# Altium schematic sheet Diagrama de Blocos.SchDoc: Diagrama de Blocos
size A4; DrawnBy: João Bortolace; Revision: 1.0; SheetNumber: 1; SheetTotal: 8
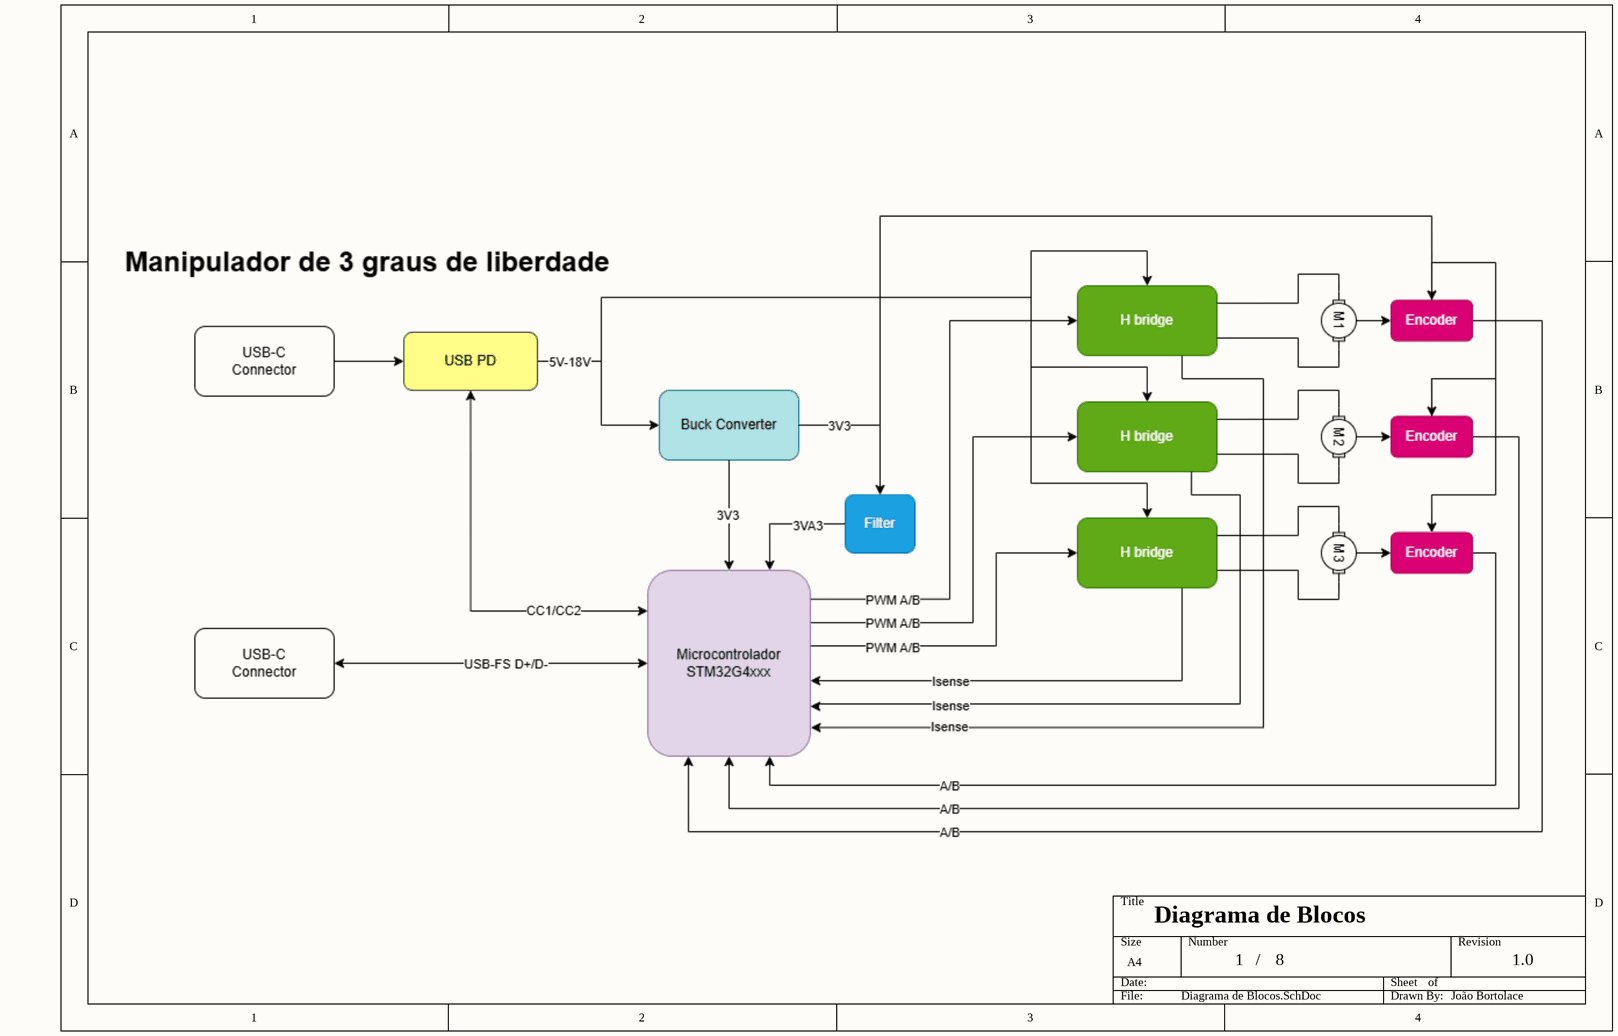
[diagram p0: Diagrama de Blocos.SchDoc]

## Notes on the sheet
- /